# EAGLE schematic Board_ESP32_n_2Bluepill (EAGLE 9.7.0)
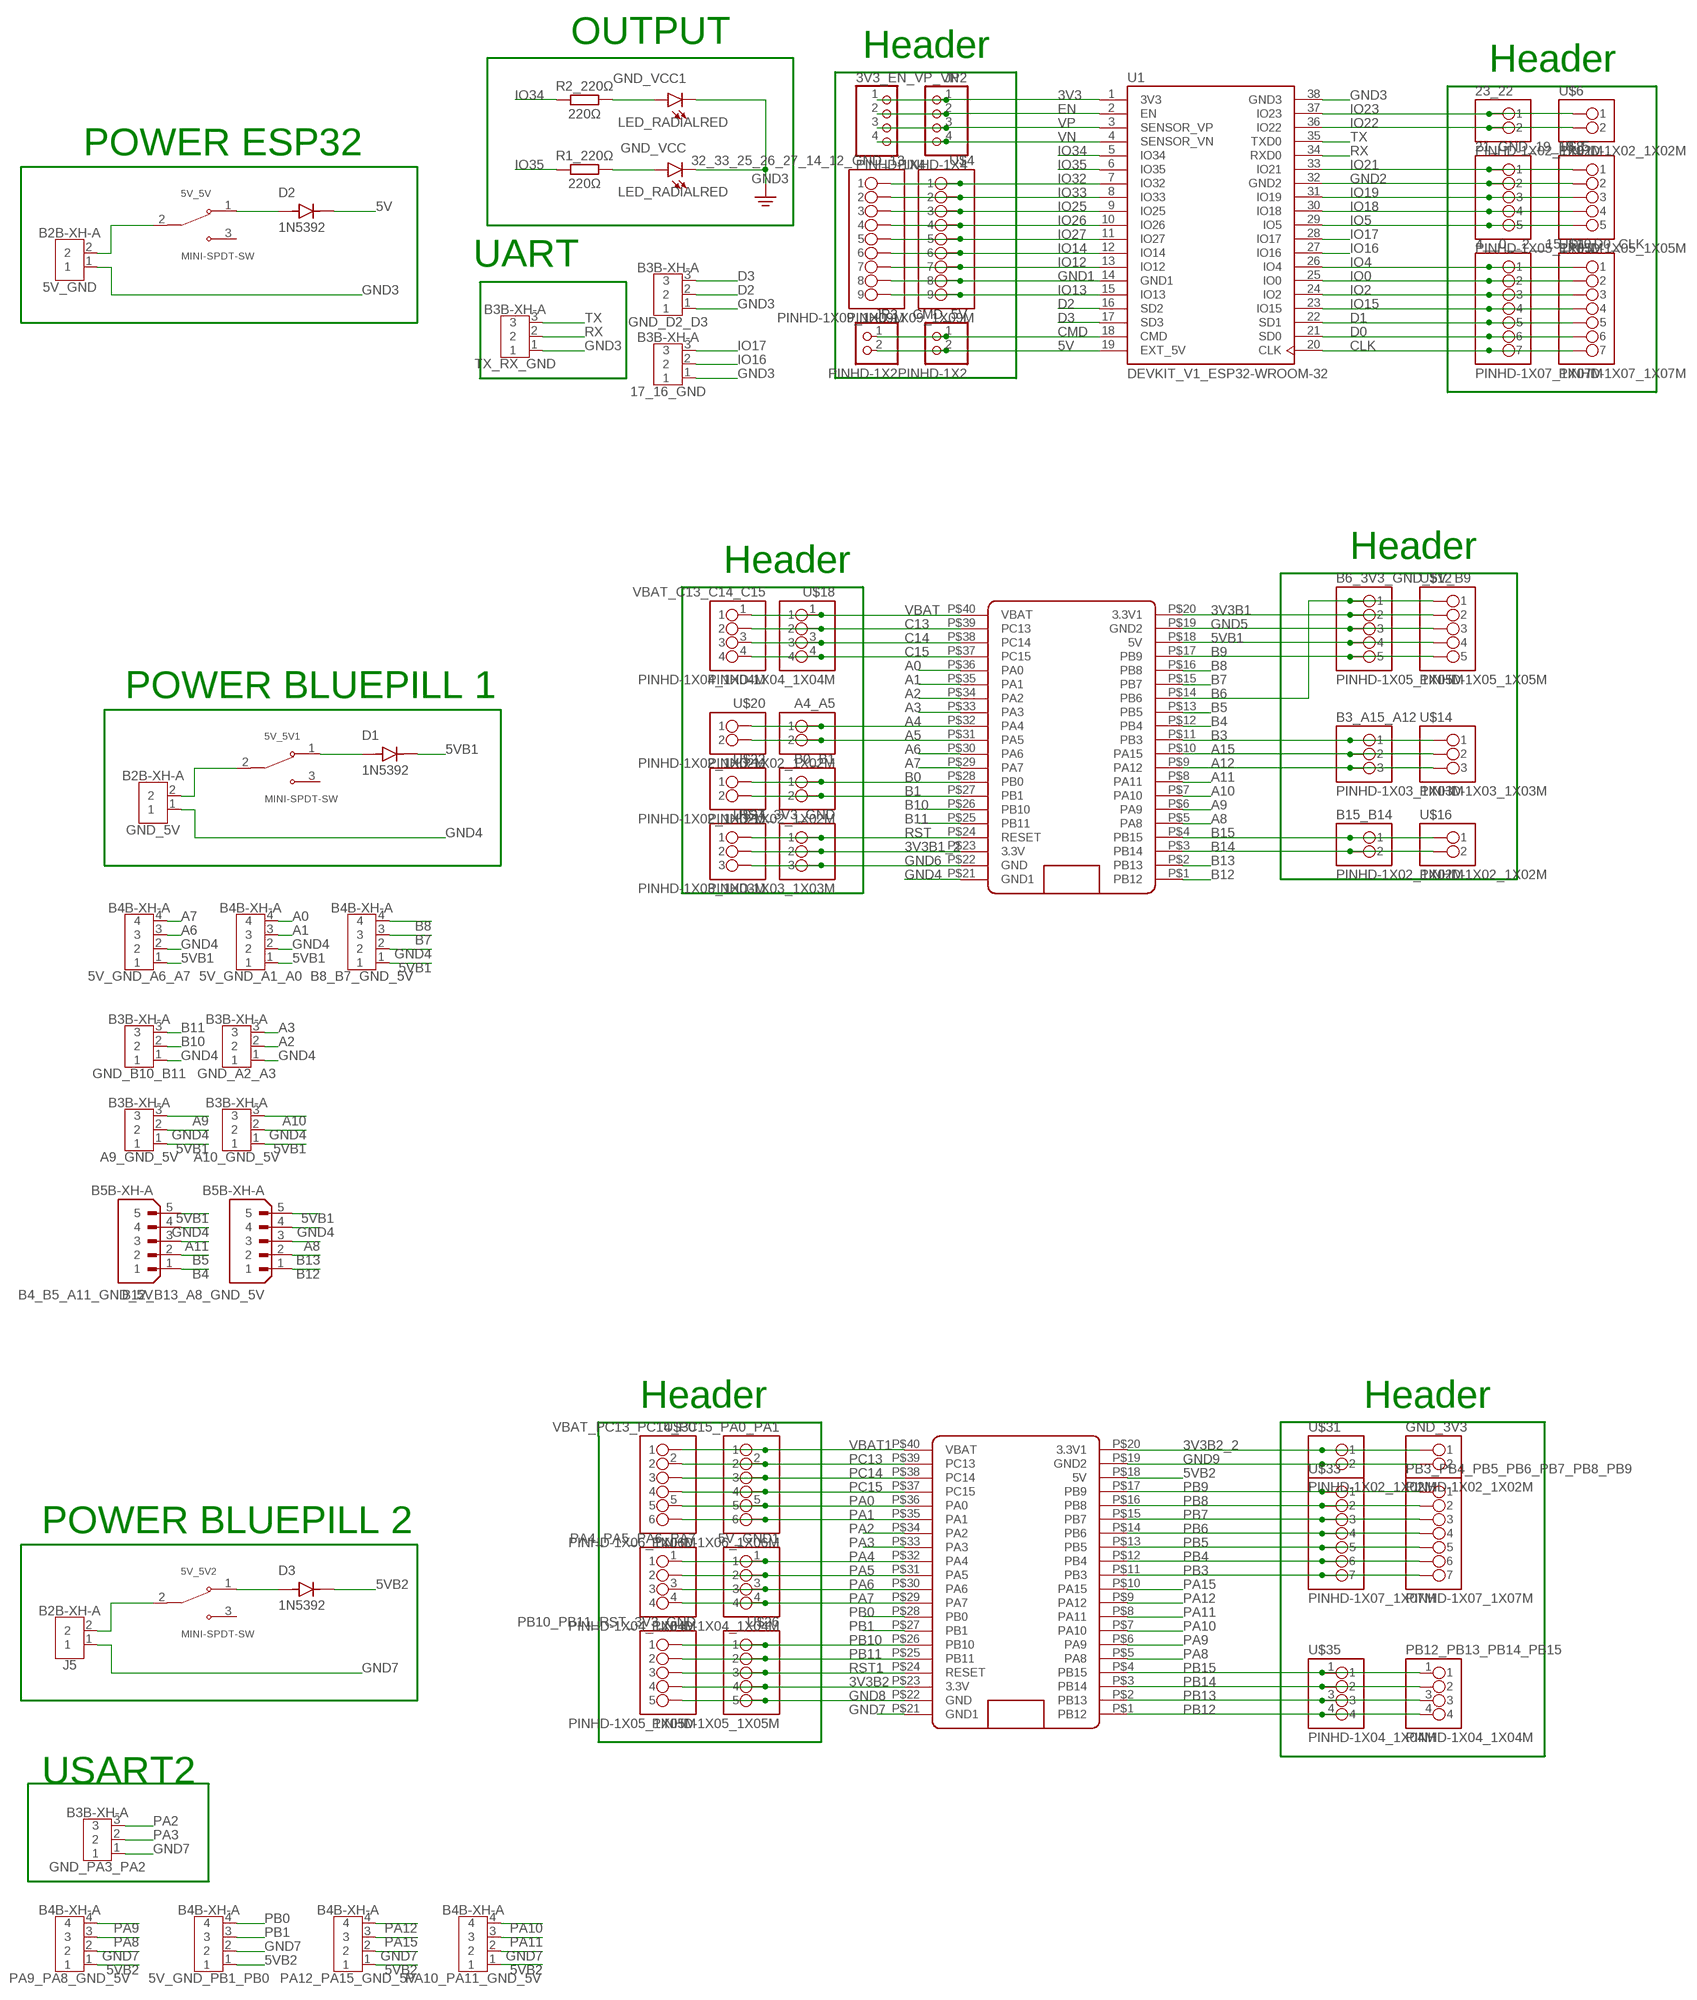
[diagram p0: schematic, sheet 1]

## Parts
3V3_EN_VP_VN  PINHD-1X4  [1X04]
4__0__2__15_D1_D0_CLK  PINHD-1X07_1X07M  [1X07]
5V_5V  MINI-SPDT-SW  [SW_MINI-SPDT-SW]
5V_5V1  MINI-SPDT-SW  [SW_MINI-SPDT-SW]
5V_5V2  MINI-SPDT-SW  [SW_MINI-SPDT-SW]
5V_GND  B2B-XH-A  [B2B-XH-A]
5V_GND1  PINHD-1X04_1X04M  [1X04]
5V_GND_A1_A0  B4B-XH-A  [B4B-XH-A]
5V_GND_A6_A7  B4B-XH-A  [B4B-XH-A]
5V_GND_PB1_PB0  B4B-XH-A  [B4B-XH-A]
17_16_GND  B3B-XH-A  [B3B-XH-A]
21_GND_19_18_5  PINHD-1X05_1X05M  [1X05]
23_22  PINHD-1X02_1X02M  [1X02]
32_33_25_26_27_14_12_GND_13  PINHD-1X09_1X09M  [1X09]
A4_A5  PINHD-1X02_1X02M  [1X02]
A9_GND_5V  B3B-XH-A  [B3B-XH-A]
A10_GND_5V  B3B-XH-A  [B3B-XH-A]
B0_B1  PINHD-1X02_1X02M  [1X02]
B3_A15_A12  PINHD-1X03_1X03M  [1X03]
B4_B5_A11_GND_5V  B5B-XH-A  [JST_B5B-XH-A]
B6_3V3_GND_5V_B9  PINHD-1X05_1X05M  [1X05]
B8_B7_GND_5V  B4B-XH-A  [B4B-XH-A]
B12_B13_A8_GND_5V  B5B-XH-A  [JST_B5B-XH-A]
B15_B14  PINHD-1X02_1X02M  [1X02]
CMD_5V  PINHD-1X2  [1X02]
D1  1N5392  [DIOAD1300W80L670D310]
D2  1N5392  [DIOAD1300W80L670D310]
D3  1N5392  [DIOAD1300W80L670D310]
GND_3V3  PINHD-1X02_1X02M  [1X02]
GND_5V  B2B-XH-A  [B2B-XH-A]
GND_A2_A3  B3B-XH-A  [B3B-XH-A]
GND_B10_B11  B3B-XH-A  [B3B-XH-A]
GND_D2_D3  B3B-XH-A  [B3B-XH-A]
GND_PA3_PA2  B3B-XH-A  [B3B-XH-A]
GND_VCC  LED_RADIALRED  [LEDRD254W60D565H860B_R]
GND_VCC1  LED_RADIALRED  [LEDRD254W60D565H860B_R]
J5  B2B-XH-A  [B2B-XH-A]
JP2  PINHD-1X4  [1X04]
JP3  PINHD-1X2  [1X02]
PA4_PA5_PA6_PA7  PINHD-1X04_1X04M  [1X04]
PA9_PA8_GND_5V  B4B-XH-A  [B4B-XH-A]
PA10_PA11_GND_5V  B4B-XH-A  [B4B-XH-A]
PA12_PA15_GND_5V  B4B-XH-A  [B4B-XH-A]
PB3_PB4_PB5_PB6_PB7_PB8_PB9  PINHD-1X07_1X07M  [1X07]
PB10_PB11_RST_3V3_GND  PINHD-1X05_1X05M  [1X05]
PB12_PB13_PB14_PB15  PINHD-1X04_1X04M  [1X04]
R1_220Ω  220Ω  R_AXIAL-11.7MM-PITCH  [RESAD1176W63L850D250B]
R2_220Ω  220Ω  R_AXIAL-11.7MM-PITCH  [RESAD1176W63L850D250B]
RST_3V3_GND  PINHD-1X03_1X03M  [1X03]
TX_RX_GND  B3B-XH-A  [B3B-XH-A]
U1  DEVKIT_V1_ESP32-WROOM-32  [MODULE_DEVKIT_V1_ESP32-WROOM-32]
U$1  BLUE_PILL  [BLUE_PILL]
U$2  BLUE_PILL  [BLUE_PILL]
U$4  PINHD-1X09_1X09M  [1X09]
U$6  PINHD-1X02_1X02M  [1X02]
U$8  PINHD-1X05_1X05M  [1X05]
U$10  PINHD-1X07_1X07M  [1X07]
U$12  PINHD-1X05_1X05M  [1X05]
U$14  PINHD-1X03_1X03M  [1X03]
U$16  PINHD-1X02_1X02M  [1X02]
U$18  PINHD-1X04_1X04M  [1X04]
U$20  PINHD-1X02_1X02M  [1X02]
U$22  PINHD-1X02_1X02M  [1X02]
U$24  PINHD-1X03_1X03M  [1X03]
U$26  PINHD-1X05_1X05M  [1X05]
U$30  PINHD-1X06_1X06M  [1X06]
U$31  PINHD-1X02_1X02M  [1X02]
U$33  PINHD-1X07_1X07M  [1X07]
U$35  PINHD-1X04_1X04M  [1X04]
VBAT_C13_C14_C15  PINHD-1X04_1X04M  [1X04]
VBAT_PC13_PC14_PC15_PA0_PA1  PINHD-1X06_1X06M  [1X06]

## Nets
3V3: 3V3_EN_VP_VN.1 JP2.1 U1.1(3V3)
3V3B1: B6_3V3_GND_5V_B9.2 U$1.P$20(3.3V1) U$12.2
3V3B1_2: RST_3V3_GND.2 U$1.P$23(3.3V) U$24.2
3V3B2: PB10_PB11_RST_3V3_GND.4 U$2.P$23(3.3V) U$26.4
3V3B2_2: GND_3V3.1 U$2.P$20(3.3V1) U$31.1
5V: CMD_5V.2 D2.C(K) JP3.2 U1.19(EXT_5V)
5V_FB1: 5V_5V.2 5V_GND.2
5V_FB2: 5V_5V1.2 GND_5V.2
5V_FB3: 5V_5V2.2 J5.2
5VB1: 5V_GND_A1_A0.1 5V_GND_A6_A7.1 A9_GND_5V.1 A10_GND_5V.1 B4_B5_A11_GND_5V.5 B6_3V3_GND_5V_B9.4 B8_B7_GND_5V.1 B12_B13_A8_GND_5V.5 D1.C(K) U$1.P$18(5V) U$12.4
5VB2: 5V_GND_PB1_PB0.1 D3.C(K) PA9_PA8_GND_5V.1 PA10_PA11_GND_5V.1 PA12_PA15_GND_5V.1 U$2.P$18(5V)
A0: 5V_GND_A1_A0.4 U$1.P$36(PA0)
A1: 5V_GND_A1_A0.3 U$1.P$35(PA1)
A2: GND_A2_A3.2 U$1.P$34(PA2)
A3: GND_A2_A3.3 U$1.P$33(PA3)
A4: A4_A5.1 U$1.P$32(PA4) U$20.1
A5: A4_A5.2 U$1.P$31(PA5) U$20.2
A6: 5V_GND_A6_A7.3 U$1.P$30(PA6)
A7: 5V_GND_A6_A7.4 U$1.P$29(PA7)
A8: B12_B13_A8_GND_5V.3 U$1.P$5(PA8)
A9: A9_GND_5V.3 U$1.P$6(PA9)
A10: A10_GND_5V.3 U$1.P$7(PA10)
A11: B4_B5_A11_GND_5V.3 U$1.P$8(PA11)
A12: B3_A15_A12.3 U$1.P$9(PA12) U$14.3
A15: B3_A15_A12.2 U$1.P$10(PA15) U$14.2
B0: B0_B1.1 U$1.P$28(PB0) U$22.1
B1: B0_B1.2 U$1.P$27(PB1) U$22.2
B3: B3_A15_A12.1 U$1.P$11(PB3) U$14.1
B4: B4_B5_A11_GND_5V.1 U$1.P$12(PB4)
B5: B4_B5_A11_GND_5V.2 U$1.P$13(PB5)
B6: B6_3V3_GND_5V_B9.1 U$1.P$14(PB6) U$12.1
B7: B8_B7_GND_5V.3 U$1.P$15(PB7)
B8: B8_B7_GND_5V.4 U$1.P$16(PB8)
B9: B6_3V3_GND_5V_B9.5 U$1.P$17(PB9) U$12.5
B10: GND_B10_B11.2 U$1.P$26(PB10)
B11: GND_B10_B11.3 U$1.P$25(PB11)
B12: B12_B13_A8_GND_5V.1 U$1.P$1(PB12)
B13: B12_B13_A8_GND_5V.2 U$1.P$2(PB13)
B14: B15_B14.2 U$1.P$3(PB14) U$16.2
B15: B15_B14.1 U$1.P$4(PB15) U$16.1
C13: U$1.P$39(PC13) U$18.2 VBAT_C13_C14_C15.2
C14: U$1.P$38(PC14) U$18.3 VBAT_C13_C14_C15.3
C15: U$1.P$37(PC15) U$18.4 VBAT_C13_C14_C15.4
CLK: 4__0__2__15_D1_D0_CLK.7 U1.20(CLK) U$10.7
CMD: CMD_5V.1 JP3.1 U1.18(CMD)
D0: 4__0__2__15_D1_D0_CLK.6 U1.21(SD0) U$10.6
D1: 4__0__2__15_D1_D0_CLK.5 U1.22(SD1) U$10.5
D2: GND_D2_D3.2 U1.16(SD2)
D3: GND_D2_D3.3 U1.17(SD3)
EN: 3V3_EN_VP_VN.2 JP2.2 U1.2(EN)
GND1: 32_33_25_26_27_14_12_GND_13.8 U1.14(GND1) U$4.8
GND2: 21_GND_19_18_5.2 U1.32(GND2) U$8.2
GND3: 5V_GND.1 17_16_GND.1 GND_D2_D3.1 GND_VCC1.C GND_VCC.C TX_RX_GND.1 U1.38(GND3) ; supply symbol labelled GND
GND4: 5V_GND_A1_A0.2 5V_GND_A6_A7.2 A9_GND_5V.2 A10_GND_5V.2 B4_B5_A11_GND_5V.4 B8_B7_GND_5V.2 B12_B13_A8_GND_5V.4 GND_5V.1 GND_A2_A3.1 GND_B10_B11.1 U$1.P$21(GND1)
GND5: B6_3V3_GND_5V_B9.3 U$1.P$19(GND2) U$12.3
GND6: RST_3V3_GND.3 U$1.P$22(GND) U$24.3
GND7: 5V_GND_PB1_PB0.2 GND_PA3_PA2.1 J5.1 PA9_PA8_GND_5V.2 PA10_PA11_GND_5V.2 PA12_PA15_GND_5V.2 U$2.P$21(GND1)
GND8: PB10_PB11_RST_3V3_GND.5 U$2.P$22(GND) U$26.5
GND9: GND_3V3.2 U$2.P$19(GND2) U$31.2
IO0: 4__0__2__15_D1_D0_CLK.2 U1.25(IO0) U$10.2
IO2: 4__0__2__15_D1_D0_CLK.3 U1.24(IO2) U$10.3
IO4: 4__0__2__15_D1_D0_CLK.1 U1.26(IO4) U$10.1
IO5: 21_GND_19_18_5.5 U1.29(IO5) U$8.5
IO12: 32_33_25_26_27_14_12_GND_13.7 U1.13(IO12) U$4.7
IO13: 32_33_25_26_27_14_12_GND_13.9 U1.15(IO13) U$4.9
IO14: 32_33_25_26_27_14_12_GND_13.6 U1.12(IO14) U$4.6
IO15: 4__0__2__15_D1_D0_CLK.4 U1.23(IO15) U$10.4
IO16: 17_16_GND.2 U1.27(IO16)
IO17: 17_16_GND.3 U1.28(IO17)
IO18: 21_GND_19_18_5.4 U1.30(IO18) U$8.4
IO19: 21_GND_19_18_5.3 U1.31(IO19) U$8.3
IO21: 21_GND_19_18_5.1 U1.33(IO21) U$8.1
IO22: 23_22.2 U1.36(IO22) U$6.2
IO23: 23_22.1 U1.37(IO23) U$6.1
IO25: 32_33_25_26_27_14_12_GND_13.3 U1.9(IO25) U$4.3
IO26: 32_33_25_26_27_14_12_GND_13.4 U1.10(IO26) U$4.4
IO27: 32_33_25_26_27_14_12_GND_13.5 U1.11(IO27) U$4.5
IO32: 32_33_25_26_27_14_12_GND_13.1 U1.7(IO32) U$4.1
IO33: 32_33_25_26_27_14_12_GND_13.2 U1.8(IO33) U$4.2
IO34: R2_220Ω.1 U1.5(IO34)
IO35: R1_220Ω.1 U1.6(IO35)
N$1: GND_VCC1.A R2_220Ω.2
N$2: GND_VCC.A R1_220Ω.2
N$9: 5V_5V.1 D2.A
N$19: 5V_5V2.1 D3.A
N$20: 5V_5V1.1 D1.A
PA0: U$2.P$36(PA0) U$30.5 VBAT_PC13_PC14_PC15_PA0_PA1.5
PA1: U$2.P$35(PA1) U$30.6 VBAT_PC13_PC14_PC15_PA0_PA1.6
PA2: GND_PA3_PA2.3 U$2.P$34(PA2)
PA3: GND_PA3_PA2.2 U$2.P$33(PA3)
PA4: 5V_GND1.1 PA4_PA5_PA6_PA7.1 U$2.P$32(PA4)
PA5: 5V_GND1.2 PA4_PA5_PA6_PA7.2 U$2.P$31(PA5)
PA6: 5V_GND1.3 PA4_PA5_PA6_PA7.3 U$2.P$30(PA6)
PA7: 5V_GND1.4 PA4_PA5_PA6_PA7.4 U$2.P$29(PA7)
PA8: PA9_PA8_GND_5V.3 U$2.P$5(PA8)
PA9: PA9_PA8_GND_5V.4 U$2.P$6(PA9)
PA10: PA10_PA11_GND_5V.4 U$2.P$7(PA10)
PA11: PA10_PA11_GND_5V.3 U$2.P$8(PA11)
PA12: PA12_PA15_GND_5V.4 U$2.P$9(PA12)
PA15: PA12_PA15_GND_5V.3 U$2.P$10(PA15)
PB0: 5V_GND_PB1_PB0.4 U$2.P$28(PB0)
PB1: 5V_GND_PB1_PB0.3 U$2.P$27(PB1)
PB3: PB3_PB4_PB5_PB6_PB7_PB8_PB9.7 U$2.P$11(PB3) U$33.7
PB4: PB3_PB4_PB5_PB6_PB7_PB8_PB9.6 U$2.P$12(PB4) U$33.6
PB5: PB3_PB4_PB5_PB6_PB7_PB8_PB9.5 U$2.P$13(PB5) U$33.5
PB6: PB3_PB4_PB5_PB6_PB7_PB8_PB9.4 U$2.P$14(PB6) U$33.4
PB7: PB3_PB4_PB5_PB6_PB7_PB8_PB9.3 U$2.P$15(PB7) U$33.3
PB8: PB3_PB4_PB5_PB6_PB7_PB8_PB9.2 U$2.P$16(PB8) U$33.2
PB9: PB3_PB4_PB5_PB6_PB7_PB8_PB9.1 U$2.P$17(PB9) U$33.1
PB10: PB10_PB11_RST_3V3_GND.1 U$2.P$26(PB10) U$26.1
PB11: PB10_PB11_RST_3V3_GND.2 U$2.P$25(PB11) U$26.2
PB12: PB12_PB13_PB14_PB15.4 U$2.P$1(PB12) U$35.4
PB13: PB12_PB13_PB14_PB15.3 U$2.P$2(PB13) U$35.3
PB14: PB12_PB13_PB14_PB15.2 U$2.P$3(PB14) U$35.2
PB15: PB12_PB13_PB14_PB15.1 U$2.P$4(PB15) U$35.1
PC13: U$2.P$39(PC13) U$30.2 VBAT_PC13_PC14_PC15_PA0_PA1.2
PC14: U$2.P$38(PC14) U$30.3 VBAT_PC13_PC14_PC15_PA0_PA1.3
PC15: U$2.P$37(PC15) U$30.4 VBAT_PC13_PC14_PC15_PA0_PA1.4
RST: RST_3V3_GND.1 U$1.P$24(RESET) U$24.1
RST1: PB10_PB11_RST_3V3_GND.3 U$2.P$24(RESET) U$26.3
RX: TX_RX_GND.2 U1.34(RXD0)
TX: TX_RX_GND.3 U1.35(TXD0)
VBAT: U$1.P$40(VBAT) U$18.1 VBAT_C13_C14_C15.1
VBAT1: U$2.P$40(VBAT) U$30.1 VBAT_PC13_PC14_PC15_PA0_PA1.1
VN: 3V3_EN_VP_VN.4 JP2.4 U1.4(SENSOR_VN)
VP: 3V3_EN_VP_VN.3 JP2.3 U1.3(SENSOR_VP)
Unconnected: 5V_5V1.3 5V_5V2.3 5V_5V.3

## Buses
B$1
B$2
B$3
B$4
B$5
B$6

## Notes on the sheet
- OUTPUT
- Header
- Header
- POWER ESP32
- UART
- Header
- Header
- POWER BLUEPILL 1
- Header | Header
- POWER BLUEPILL 2
- USART2

## Library data of the parts
3V3_EN_VP_VN JP2 = Connector:PINHD-1X4: PIN HEADER; CATEGORY: Headers; DESCRIPTION: Header-Straight-4 Position; PACKAGE_TYPE: THT; PITCH: 0.100" (2.54mm); SUBCATEGORY: Headers-Male Pins; TYPE: Board to Board or Cable-Unshrouded-Through Hole-Straight
4__0__2__15_D1_D0_CLK PB3_PB4_PB5_PB6_PB7_PB8_PB9 U$10 U$33 = Tinkercad:PINHD-1X07
5V_5V 5V_5V1 5V_5V2 = MINI-SPDT-SW:MINI-SPDT-SW: Simple breadboard friendly SPDT slide switch. Rated at 30V/200mA with operating force of 250 +/-100gf. Check availability <https://pricing.snapeda.com/parts/MINI-SPDT-SW/Gravitech/view-part?ref=eda>; AVAILABILITY: Not in stock; CHECK_PRICES: https://www.snapeda.com/parts/MINI-SPDT-SW/Gravitech/view-part/?ref=eda; DESCRIPTION: Slide Switches MINI SPDT SWITCH; MF: Gravitech; MP: MINI-SPDT-SW; PACKAGE: None; PRICE: None; SNAPEDA_LINK: https://www.snapeda.com/parts/MINI-SPDT-SW/Gravitech/view-part/?ref=snap
5V_GND GND_5V J5 = Connector:B2B-XH-A: XH Connector Top Entry - 2POS Details see: Datasheet <http://www.jst-mfg.com/product/pdf/eng/eXH.pdf>; CATEGORY: Header; DATASHEET: https://www.jst-mfg.com/product/pdf/eng/eXH.pdf?67404de0bbae1; DESCRIPTION: Connector Header Through Hole 2 position 0.098" (2.50mm); MANUFACTURER: JST Sales America Inc.; MPN: B2B-XH-A; OPERATING_TEMPERATURE: -25°C ~ 85°C; PACKAGE_SIZE: NA; PACKAGE_TYPE: THT; PART_STATUS: ACTIVE; PITCH: 0.098" (2.50mm); ROHS: COMPLIANT; SERIES: XH; SUBCATEGORY: Rectangular Connectors; TYPE: Header-Male Pin-Board to Cable/Wire-Through Hole
5V_GND1 PA4_PA5_PA6_PA7 PB12_PB13_PB14_PB15 U$18 U$35 VBAT_C13_C14_C15 = Tinkercad:PINHD-1X04
5V_GND_A1_A0 5V_GND_A6_A7 5V_GND_PB1_PB0 B8_B7_GND_5V PA9_PA8_GND_5V PA10_PA11_GND_5V PA12_PA15_GND_5V = Connector:B4B-XH-A: XH Connector Top Entry - 4POS Details see: Datasheet <http://www.jst-mfg.com/product/pdf/eng/eXH.pdf>; CATEGORY: Header; DATASHEET: https://www.jst-mfg.com/product/pdf/eng/eXH.pdf?67404de0bbae1; DESCRIPTION: Connector Header Through Hole 4 position 0.098" (2.50mm); MANUFACTURER: JST Sales America Inc.; MPN: B4B-XH-A; OPERATING_TEMPERATURE: -25°C ~ 85°C; PACKAGE_SIZE: NA; PACKAGE_TYPE: THT; PART_STATUS: ACTIVE; PITCH: 0.098" (2.50mm); ROHS: COMPLIANT; SERIES: XH; SUBCATEGORY: Rectangular Connectors; TYPE: Header-Male Pin-Board to Cable/Wire-Through Hole
17_16_GND A9_GND_5V A10_GND_5V GND_A2_A3 GND_B10_B11 GND_D2_D3 GND_PA3_PA2 TX_RX_GND = Connector:B3B-XH-A: XH Connector Top Entry - 3POS Details see: Datasheet <http://www.jst-mfg.com/product/pdf/eng/eXH.pdf>; CATEGORY: Header; DATASHEET: https://www.jst-mfg.com/product/pdf/eng/eXH.pdf?67404de0bbae1; DESCRIPTION: Connector Header Through Hole 3 position 0.098" (2.50mm); MANUFACTURER: JST Sales America Inc.; MPN: B3B-XH-A; OPERATING_TEMPERATURE: -25°C ~ 85°C; PACKAGE_SIZE: NA; PACKAGE_TYPE: THT; PART_STATUS: ACTIVE; PITCH: 0.098" (2.50mm); ROHS: COMPLIANT; SERIES: XH; SUBCATEGORY: Rectangular Connectors; TYPE: Header-Male Pin-Board to Cable/Wire-Through Hole
21_GND_19_18_5 B6_3V3_GND_5V_B9 PB10_PB11_RST_3V3_GND U$8 U$12 U$26 = Tinkercad:PINHD-1X05
23_22 A4_A5 B0_B1 B15_B14 GND_3V3 U$6 U$16 U$20 U$22 U$31 = Tinkercad:PINHD-1X02
32_33_25_26_27_14_12_GND_13 U$4 = Tinkercad:PINHD-1X09
B3_A15_A12 RST_3V3_GND U$14 U$24 = Tinkercad:PINHD-1X03
B4_B5_A11_GND_5V B12_B13_A8_GND_5V = B5B-XH-A:B5B-XH-A: Check availability <https://pricing.snapeda.com/parts/B5B-XH-A/JST%20Sales/view-part?ref=eda>; AVAILABILITY: In Stock; CHECK_PRICES: https://www.snapeda.com/parts/B5B-XH-A/JST/view-part/?ref=eda; DESCRIPTION: Connector Header Through Hole 5 position 0.098 (2.50mm); MF: JST Sales; MP: B5B-XH-A; PACKAGE: None; PRICE: None; SNAPEDA_LINK: https://www.snapeda.com/parts/B5B-XH-A/JST/view-part/?ref=snap
CMD_5V JP3 = Connector:PINHD-1X2: PIN HEADER; CATEGORY: Headers; DESCRIPTION: Header-Straight-2 Position; PACKAGE_TYPE: THT; PITCH: 0.100" (2.54mm); SUBCATEGORY: Headers-Male Pins; TYPE: Board to Board or Cable-Unshrouded-Through Hole-Straight
D1-D3 = 1N5392:1N5392: Check availability <https://pricing.snapeda.com/parts/1N5392/ON%20Semiconductor/view-part?ref=eda>; AVAILABILITY: In Stock; CHECK_PRICES: https://www.snapeda.com/parts/1N5392/Onsemi/view-part/?ref=eda; DESCRIPTION: Diode Standard 100 V 1.5A Through Hole DO-15; MF: ON Semiconductor; MP: 1N5392; PACKAGE: None; PRICE: None; SNAPEDA_LINK: https://www.snapeda.com/parts/1N5392/Onsemi/view-part/?ref=snap
GND_VCC GND_VCC1 = Opto-Electronic:LED_RADIAL: LED - Generic
R1_220Ω R2_220Ω = Resistor:R: Resistor Fixed - Generic; CATEGORY: Resistor; SUB-CATEGORY: Fixed
U1 = DEVKIT_V1_ESP32-WROOM-32:DEVKIT_V1_ESP32-WROOM-32: Check availability <https://pricing.snapeda.com/parts/DEVKIT%20V1%20ESP32-WROOM-32/Espressif%20Systems/view-part?ref=eda>; AVAILABILITY: Not in stock; CHECK_PRICES: https://www.snapeda.com/parts/DEVKIT%20V1%20ESP32-WROOM-32/Espressif+Systems/view-part/?ref=eda; DESCRIPTION: WROOM-32 Development Board ESP32 ESP-32S WiFi Bluetooth Dev Module; MF: Espressif Systems; MP: DEVKIT V1 ESP32-WROOM-32; PACKAGE: Package; PRICE: None; SNAPEDA_LINK: https://www.snapeda.com/parts/DEVKIT%20V1%20ESP32-WROOM-32/Espressif+Systems/view-part/?ref=snap
U$1 U$2 = BluePill:BLUE_PILL
U$30 VBAT_PC13_PC14_PC15_PA0_PA1 = Tinkercad:PINHD-1X06